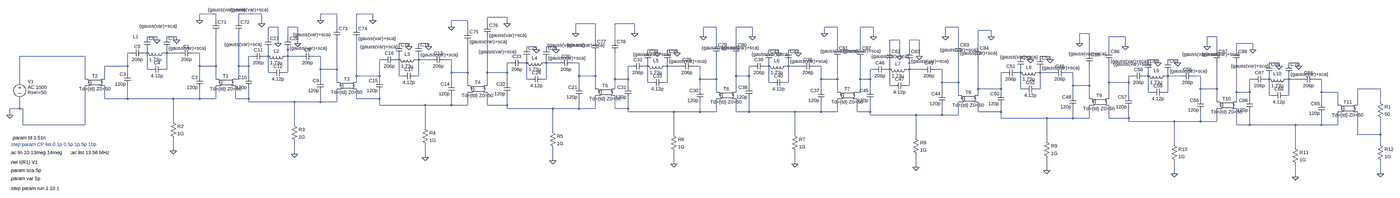
[diagram p0: schematic LTL_doubleside.asc, whole sheet]
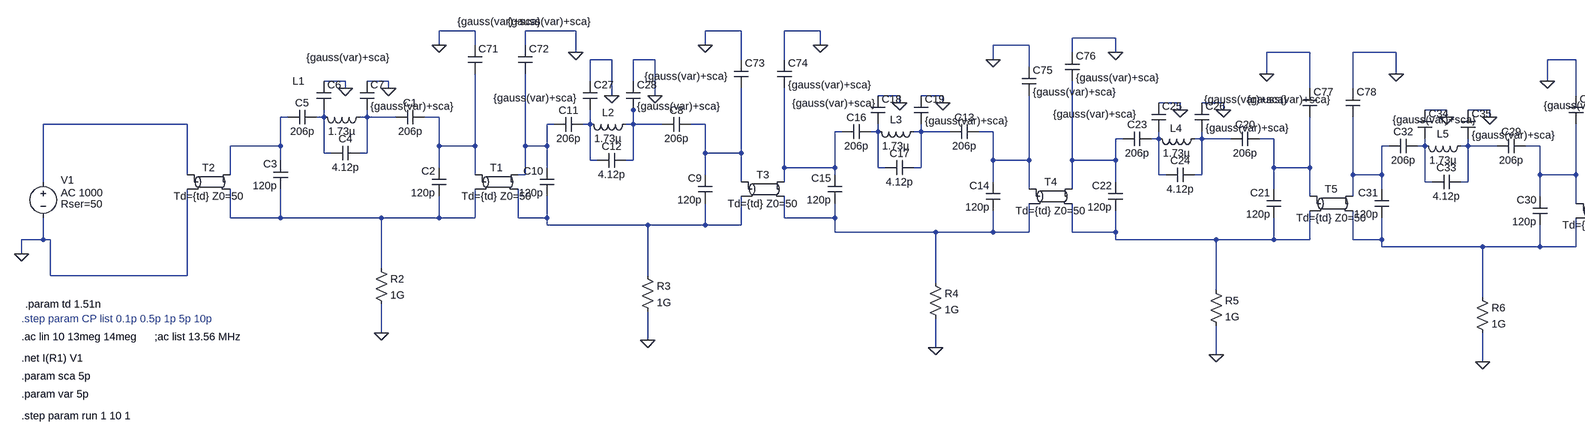
[diagram p1: schematic LTL_doubleside.asc, part, row 1 of 1, column 1 of 2]
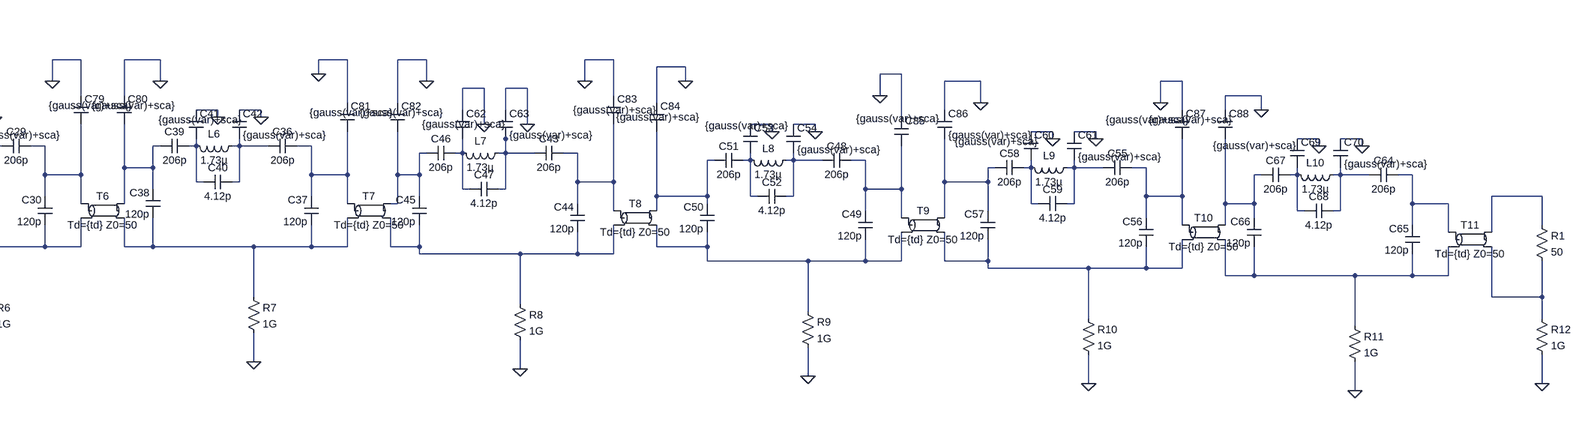
[diagram p2: schematic LTL_doubleside.asc, part, row 1 of 1, column 2 of 2]
LTL_doubleside.asc, the LTspice schematic file:
Version 4
SHEET 1 1680 680
WIRE -8800 -496 -8880 -496
WIRE -8576 -496 -8688 -496
WIRE -8208 -496 -8288 -496
WIRE -8032 -496 -8112 -496
WIRE -7376 -480 -7472 -480
WIRE -8880 -464 -8880 -496
WIRE -8800 -464 -8800 -496
WIRE -8688 -464 -8688 -496
WIRE -8288 -464 -8288 -496
WIRE -8032 -464 -8032 -496
WIRE -7568 -464 -7648 -464
WIRE -8576 -448 -8576 -496
WIRE -7472 -448 -7472 -480
WIRE -7376 -448 -7376 -480
WIRE -6944 -448 -7040 -448
WIRE -6752 -448 -6848 -448
WIRE -8496 -432 -8544 -432
WIRE -8400 -432 -8448 -432
WIRE -8208 -432 -8208 -496
WIRE -8112 -432 -8112 -496
WIRE -7648 -432 -7648 -464
WIRE -6352 -432 -6416 -432
WIRE -6176 -432 -6256 -432
WIRE -5760 -432 -5824 -432
WIRE -5584 -432 -5648 -432
WIRE -5168 -432 -5232 -432
WIRE -7568 -416 -7568 -464
WIRE -5008 -416 -5072 -416
WIRE -7040 -400 -7040 -448
WIRE -6752 -400 -6752 -448
WIRE -5824 -400 -5824 -432
WIRE -4528 -400 -4576 -400
WIRE -9088 -384 -9136 -384
WIRE -8992 -384 -9040 -384
WIRE -8544 -384 -8544 -432
WIRE -8448 -384 -8448 -432
WIRE -6416 -384 -6416 -432
WIRE -6176 -384 -6176 -432
WIRE -5584 -384 -5584 -432
WIRE -5232 -384 -5232 -432
WIRE -5008 -384 -5008 -416
WIRE -4352 -384 -4432 -384
WIRE -3904 -384 -3952 -384
WIRE -9088 -368 -9088 -384
WIRE -8992 -368 -8992 -384
WIRE -6944 -368 -6944 -448
WIRE -6848 -368 -6848 -448
WIRE -5456 -368 -5504 -368
WIRE -5360 -368 -5408 -368
WIRE -8496 -352 -8496 -432
WIRE -8400 -352 -8400 -432
WIRE -7856 -352 -7904 -352
WIRE -7760 -352 -7808 -352
WIRE -6352 -352 -6352 -432
WIRE -6256 -352 -6256 -432
WIRE -5168 -352 -5168 -432
WIRE -4576 -352 -4576 -400
WIRE -3728 -352 -3808 -352
WIRE -7856 -336 -7856 -352
WIRE -7760 -336 -7760 -352
WIRE -7232 -336 -7280 -336
WIRE -7136 -336 -7184 -336
WIRE -5760 -336 -5760 -432
WIRE -5648 -336 -5648 -432
WIRE -5072 -336 -5072 -416
WIRE -4352 -336 -4352 -384
WIRE -3952 -336 -3952 -384
WIRE -8448 -320 -8448 -336
WIRE -7232 -320 -7232 -336
WIRE -7136 -320 -7136 -336
WIRE -6640 -320 -6688 -320
WIRE -6544 -320 -6592 -320
WIRE -6048 -320 -6096 -320
WIRE -5952 -320 -6000 -320
WIRE -5504 -320 -5504 -368
WIRE -5408 -320 -5408 -368
WIRE -4432 -320 -4432 -384
WIRE -3904 -320 -3904 -384
WIRE -3808 -320 -3808 -352
WIRE -3728 -320 -3728 -352
WIRE -9216 -304 -9232 -304
WIRE -9136 -304 -9136 -320
WIRE -9136 -304 -9152 -304
WIRE -9040 -304 -9040 -320
WIRE -9040 -304 -9056 -304
WIRE -8976 -304 -9040 -304
WIRE -8880 -304 -8912 -304
WIRE -6640 -304 -6640 -320
WIRE -6544 -304 -6544 -320
WIRE -6048 -304 -6048 -320
WIRE -5952 -304 -5952 -320
WIRE -4528 -304 -4528 -400
WIRE -9440 -288 -9760 -288
WIRE -8624 -288 -8640 -288
WIRE -8544 -288 -8544 -320
WIRE -8544 -288 -8560 -288
WIRE -8448 -288 -8448 -320
WIRE -8448 -288 -8464 -288
WIRE -8384 -288 -8448 -288
WIRE -8288 -288 -8320 -288
WIRE -5456 -288 -5456 -368
WIRE -5360 -288 -5360 -368
WIRE -4816 -288 -4864 -288
WIRE -4720 -288 -4768 -288
WIRE -7984 -272 -8000 -272
WIRE -7904 -272 -7904 -288
WIRE -7904 -272 -7920 -272
WIRE -7808 -272 -7808 -288
WIRE -7808 -272 -7824 -272
WIRE -7744 -272 -7808 -272
WIRE -7648 -272 -7680 -272
WIRE -4816 -272 -4816 -288
WIRE -4720 -272 -4720 -288
WIRE -4192 -272 -4240 -272
WIRE -4096 -272 -4144 -272
WIRE -7360 -256 -7376 -256
WIRE -7280 -256 -7280 -272
WIRE -7280 -256 -7296 -256
WIRE -7184 -256 -7184 -272
WIRE -7184 -256 -7200 -256
WIRE -7120 -256 -7184 -256
WIRE -7024 -256 -7056 -256
WIRE -5408 -256 -5408 -272
WIRE -4192 -256 -4192 -272
WIRE -4096 -256 -4096 -272
WIRE -3600 -256 -3648 -256
WIRE -3504 -256 -3552 -256
WIRE -9232 -240 -9232 -304
WIRE -9232 -240 -9344 -240
WIRE -8880 -240 -8880 -304
WIRE -8800 -240 -8800 -400
WIRE -8800 -240 -8880 -240
WIRE -8688 -240 -8688 -400
WIRE -8640 -240 -8640 -288
WIRE -8640 -240 -8688 -240
WIRE -6768 -240 -6784 -240
WIRE -6688 -240 -6688 -256
WIRE -6688 -240 -6704 -240
WIRE -6592 -240 -6592 -256
WIRE -6592 -240 -6608 -240
WIRE -6528 -240 -6592 -240
WIRE -6432 -240 -6464 -240
WIRE -6176 -240 -6192 -240
WIRE -6096 -240 -6096 -256
WIRE -6096 -240 -6112 -240
WIRE -6000 -240 -6000 -256
WIRE -6000 -240 -6016 -240
WIRE -5936 -240 -6000 -240
WIRE -5840 -240 -5872 -240
WIRE -3600 -240 -3600 -256
WIRE -3504 -240 -3504 -256
WIRE -9136 -224 -9136 -304
WIRE -9120 -224 -9136 -224
WIRE -9040 -224 -9040 -304
WIRE -9040 -224 -9056 -224
WIRE -8288 -224 -8288 -288
WIRE -8208 -224 -8208 -368
WIRE -8208 -224 -8288 -224
WIRE -5584 -224 -5600 -224
WIRE -5504 -224 -5504 -256
WIRE -5504 -224 -5520 -224
WIRE -5408 -224 -5408 -256
WIRE -5408 -224 -5424 -224
WIRE -5344 -224 -5408 -224
WIRE -5248 -224 -5280 -224
WIRE -9232 -208 -9232 -240
WIRE -8544 -208 -8544 -288
WIRE -8528 -208 -8544 -208
WIRE -8448 -208 -8448 -288
WIRE -8448 -208 -8464 -208
WIRE -7648 -208 -7648 -272
WIRE -7568 -208 -7568 -352
WIRE -7568 -208 -7648 -208
WIRE -7472 -208 -7472 -384
WIRE -7376 -208 -7376 -256
WIRE -7376 -208 -7472 -208
WIRE -4944 -208 -4960 -208
WIRE -4864 -208 -4864 -224
WIRE -4864 -208 -4880 -208
WIRE -4768 -208 -4768 -224
WIRE -4768 -208 -4784 -208
WIRE -4704 -208 -4768 -208
WIRE -4608 -208 -4640 -208
WIRE -8880 -192 -8880 -240
WIRE -8640 -192 -8640 -240
WIRE -8112 -192 -8112 -368
WIRE -8000 -192 -8000 -272
WIRE -8000 -192 -8112 -192
WIRE -7904 -192 -7904 -272
WIRE -7888 -192 -7904 -192
WIRE -7808 -192 -7808 -272
WIRE -7808 -192 -7824 -192
WIRE -7024 -192 -7024 -256
WIRE -6944 -192 -6944 -304
WIRE -6944 -192 -7024 -192
WIRE -6256 -192 -6256 -288
WIRE -6192 -192 -6192 -240
WIRE -6192 -192 -6256 -192
WIRE -4320 -192 -4336 -192
WIRE -4240 -192 -4240 -208
WIRE -4240 -192 -4256 -192
WIRE -4144 -192 -4144 -208
WIRE -4144 -192 -4160 -192
WIRE -4080 -192 -4144 -192
WIRE -3984 -192 -4016 -192
WIRE -9440 -176 -9440 -288
WIRE -9344 -176 -9344 -240
WIRE -8800 -176 -8800 -240
WIRE -8688 -176 -8688 -240
WIRE -8688 -176 -8704 -176
WIRE -8288 -176 -8288 -224
WIRE -8000 -176 -8000 -192
WIRE -7280 -176 -7280 -256
WIRE -7264 -176 -7280 -176
WIRE -7184 -176 -7184 -256
WIRE -7184 -176 -7200 -176
WIRE -6848 -176 -6848 -304
WIRE -6784 -176 -6784 -240
WIRE -6784 -176 -6848 -176
WIRE -6432 -176 -6432 -240
WIRE -6352 -176 -6352 -288
WIRE -6352 -176 -6432 -176
WIRE -5840 -176 -5840 -240
WIRE -5760 -176 -5760 -272
WIRE -5760 -176 -5840 -176
WIRE -5648 -176 -5648 -272
WIRE -5600 -176 -5600 -224
WIRE -5600 -176 -5648 -176
WIRE -3728 -176 -3744 -176
WIRE -3648 -176 -3648 -192
WIRE -3648 -176 -3664 -176
WIRE -3552 -176 -3552 -192
WIRE -3552 -176 -3568 -176
WIRE -3488 -176 -3552 -176
WIRE -3392 -176 -3424 -176
WIRE -9760 -160 -9760 -288
WIRE -8208 -160 -8208 -224
WIRE -8112 -160 -8112 -192
WIRE -7648 -160 -7648 -208
WIRE -7376 -160 -7376 -208
WIRE -6688 -160 -6688 -240
WIRE -6672 -160 -6688 -160
WIRE -6592 -160 -6592 -240
WIRE -6592 -160 -6608 -160
WIRE -6096 -160 -6096 -240
WIRE -6080 -160 -6096 -160
WIRE -6000 -160 -6000 -240
WIRE -6000 -160 -6016 -160
WIRE -5248 -160 -5248 -224
WIRE -5168 -160 -5168 -288
WIRE -5168 -160 -5248 -160
WIRE -4432 -160 -4432 -256
WIRE -4336 -160 -4336 -192
WIRE -4336 -160 -4432 -160
WIRE -7568 -144 -7568 -208
WIRE -7472 -144 -7472 -208
WIRE -7024 -144 -7024 -192
WIRE -6784 -144 -6784 -176
WIRE -6192 -144 -6192 -192
WIRE -5504 -144 -5504 -224
WIRE -5488 -144 -5504 -144
WIRE -5408 -144 -5408 -224
WIRE -5408 -144 -5424 -144
WIRE -4608 -144 -4608 -208
WIRE -4528 -144 -4528 -240
WIRE -4528 -144 -4608 -144
WIRE -6944 -128 -6944 -192
WIRE -6848 -128 -6848 -176
WIRE -6432 -128 -6432 -176
WIRE -5840 -128 -5840 -176
WIRE -5600 -128 -5600 -176
WIRE -5072 -128 -5072 -272
WIRE -4960 -128 -4960 -208
WIRE -4960 -128 -5072 -128
WIRE -4864 -128 -4864 -208
WIRE -4848 -128 -4864 -128
WIRE -4768 -128 -4768 -208
WIRE -4768 -128 -4784 -128
WIRE -3984 -128 -3984 -192
WIRE -3904 -128 -3904 -256
WIRE -3904 -128 -3984 -128
WIRE -3104 -128 -3216 -128
WIRE -6352 -112 -6352 -176
WIRE -6256 -112 -6256 -192
WIRE -5760 -112 -5760 -176
WIRE -5648 -112 -5648 -176
WIRE -5648 -112 -5664 -112
WIRE -5248 -112 -5248 -160
WIRE -4960 -112 -4960 -128
WIRE -4240 -112 -4240 -192
WIRE -4224 -112 -4240 -112
WIRE -4144 -112 -4144 -192
WIRE -4144 -112 -4160 -112
WIRE -3808 -112 -3808 -256
WIRE -3744 -112 -3744 -176
WIRE -3744 -112 -3808 -112
WIRE -3392 -112 -3392 -176
WIRE -3312 -112 -3392 -112
WIRE -5168 -96 -5168 -160
WIRE -5072 -96 -5072 -128
WIRE -4608 -96 -4608 -144
WIRE -4336 -96 -4336 -160
WIRE -3648 -96 -3648 -176
WIRE -3632 -96 -3648 -96
WIRE -3552 -96 -3552 -176
WIRE -3552 -96 -3568 -96
WIRE -9344 -80 -9344 -144
WIRE -9232 -80 -9232 -144
WIRE -9232 -80 -9344 -80
WIRE -9008 -80 -9232 -80
WIRE -8880 -80 -8880 -128
WIRE -8880 -80 -9008 -80
WIRE -8800 -80 -8800 -144
WIRE -8800 -80 -8880 -80
WIRE -8704 -80 -8704 -144
WIRE -8640 -80 -8640 -128
WIRE -8640 -80 -8704 -80
WIRE -8112 -80 -8112 -128
WIRE -8000 -80 -8000 -112
WIRE -8000 -80 -8112 -80
WIRE -4528 -80 -4528 -144
WIRE -4432 -80 -4432 -160
WIRE -3984 -80 -3984 -128
WIRE -3744 -80 -3744 -112
WIRE -8640 -64 -8640 -80
WIRE -8416 -64 -8640 -64
WIRE -8288 -64 -8288 -112
WIRE -8288 -64 -8416 -64
WIRE -8208 -64 -8208 -128
WIRE -8208 -64 -8288 -64
WIRE -3904 -64 -3904 -128
WIRE -3808 -64 -3808 -112
WIRE -3392 -64 -3392 -112
WIRE -3104 -64 -3104 -128
WIRE -8000 -48 -8000 -80
WIRE -7776 -48 -8000 -48
WIRE -7648 -48 -7648 -96
WIRE -7648 -48 -7776 -48
WIRE -7568 -48 -7568 -112
WIRE -7568 -48 -7648 -48
WIRE -7472 -48 -7472 -112
WIRE -7376 -48 -7376 -96
WIRE -7376 -48 -7472 -48
WIRE -3312 -48 -3312 -112
WIRE -3216 -48 -3216 -128
WIRE -9760 -32 -9760 -80
WIRE -9760 -32 -9808 -32
WIRE -9744 -32 -9760 -32
WIRE -7376 -32 -7376 -48
WIRE -7152 -32 -7376 -32
WIRE -7024 -32 -7024 -80
WIRE -7024 -32 -7152 -32
WIRE -6944 -32 -6944 -96
WIRE -6944 -32 -7024 -32
WIRE -6848 -32 -6848 -96
WIRE -6784 -32 -6784 -80
WIRE -6784 -32 -6848 -32
WIRE -6784 -16 -6784 -32
WIRE -6560 -16 -6784 -16
WIRE -6432 -16 -6432 -64
WIRE -6432 -16 -6560 -16
WIRE -6352 -16 -6352 -80
WIRE -6352 -16 -6432 -16
WIRE -6256 -16 -6256 -80
WIRE -6192 -16 -6192 -80
WIRE -6192 -16 -6256 -16
WIRE -5968 -16 -6192 -16
WIRE -5840 -16 -5840 -64
WIRE -5840 -16 -5968 -16
WIRE -5760 -16 -5760 -80
WIRE -5760 -16 -5840 -16
WIRE -5664 -16 -5664 -80
WIRE -5600 -16 -5600 -64
WIRE -5600 -16 -5664 -16
WIRE -5072 -16 -5072 -64
WIRE -4960 -16 -4960 -48
WIRE -4960 -16 -5072 -16
WIRE -9808 0 -9808 -32
WIRE -5600 0 -5600 -16
WIRE -5376 0 -5600 0
WIRE -5248 0 -5248 -48
WIRE -5248 0 -5376 0
WIRE -5168 0 -5168 -64
WIRE -5168 0 -5248 0
WIRE -4960 16 -4960 -16
WIRE -4736 16 -4960 16
WIRE -4608 16 -4608 -32
WIRE -4608 16 -4736 16
WIRE -4528 16 -4528 -48
WIRE -4528 16 -4608 16
WIRE -4432 16 -4432 -48
WIRE -4336 16 -4336 -32
WIRE -4336 16 -4432 16
WIRE -9008 32 -9008 -80
WIRE -4336 32 -4336 16
WIRE -4112 32 -4336 32
WIRE -3984 32 -3984 -16
WIRE -3984 32 -4112 32
WIRE -3904 32 -3904 -32
WIRE -3904 32 -3984 32
WIRE -9744 48 -9744 -32
WIRE -9440 48 -9440 -144
WIRE -9440 48 -9744 48
WIRE -8416 48 -8416 -64
WIRE -3808 48 -3808 -32
WIRE -3744 48 -3744 -16
WIRE -3744 48 -3808 48
WIRE -3520 48 -3744 48
WIRE -3392 48 -3392 0
WIRE -3392 48 -3520 48
WIRE -3312 48 -3312 -16
WIRE -3312 48 -3392 48
WIRE -7776 64 -7776 -48
WIRE -7152 80 -7152 -32
WIRE -6560 96 -6560 -16
WIRE -5968 96 -5968 -16
WIRE -3216 96 -3216 -16
WIRE -3104 96 -3104 16
WIRE -3104 96 -3216 96
WIRE -5376 112 -5376 0
WIRE -4736 128 -4736 16
WIRE -4112 144 -4112 32
WIRE -3104 144 -3104 96
WIRE -3520 160 -3520 48
WIRE -9008 176 -9008 112
WIRE -8416 192 -8416 128
WIRE -7776 208 -7776 144
WIRE -7152 224 -7152 160
WIRE -6560 240 -6560 176
WIRE -5968 240 -5968 176
WIRE -5376 256 -5376 192
WIRE -4736 272 -4736 208
WIRE -4112 288 -4112 224
WIRE -3104 288 -3104 224
WIRE -3520 304 -3520 240
FLAG -9808 0 0
FLAG -9008 176 0
FLAG -9088 -368 0
FLAG -8992 -368 0
FLAG -8416 192 0
FLAG -8496 -352 0
FLAG -8400 -352 0
FLAG -7776 208 0
FLAG -7856 -336 0
FLAG -7760 -336 0
FLAG -7152 224 0
FLAG -7232 -320 0
FLAG -7136 -320 0
FLAG -6560 240 0
FLAG -6640 -304 0
FLAG -6544 -304 0
FLAG -5968 240 0
FLAG -6048 -304 0
FLAG -5952 -304 0
FLAG -5376 256 0
FLAG -5456 -288 0
FLAG -5360 -288 0
FLAG -4736 272 0
FLAG -4816 -272 0
FLAG -4720 -272 0
FLAG -4112 288 0
FLAG -4192 -256 0
FLAG -4096 -256 0
FLAG -3520 304 0
FLAG -3600 -240 0
FLAG -3504 -240 0
FLAG -3104 288 0
FLAG -3728 -320 0
FLAG -3952 -336 0
FLAG -4576 -352 0
FLAG -4352 -336 0
FLAG -5232 -384 0
FLAG -5008 -384 0
FLAG -5824 -400 0
FLAG -5584 -384 0
FLAG -6416 -384 0
FLAG -6176 -384 0
FLAG -7040 -400 0
FLAG -6752 -400 0
FLAG -7648 -432 0
FLAG -7376 -448 0
FLAG -8288 -464 0
FLAG -8032 -464 0
FLAG -8880 -464 0
FLAG -8576 -448 0
SYMBOL voltage -9760 -176 R0
WINDOW 0 39 12 Left 2
WINDOW 123 39 40 Left 2
WINDOW 39 39 65 Left 2
SYMATTR InstName V1
SYMATTR Value2 AC 1000
SYMATTR SpiceLine Rser=50
SYMATTR Value ""
SYMBOL res -3120 -80 R0
SYMATTR InstName R1
SYMATTR Value 50
SYMBOL tline -8752 -160 R0
SYMATTR InstName T1
SYMATTR Value Td={td} Z0=50
SYMBOL tline -9392 -160 R0
SYMATTR InstName T2
SYMATTR Value Td={td} Z0=50
SYMBOL cap -8912 -320 R90
WINDOW 0 0 32 VBottom 2
WINDOW 3 32 32 VTop 2
SYMATTR InstName C1
SYMATTR Value 206p
SYMBOL cap -8864 -128 R180
WINDOW 0 24 56 Left 2
WINDOW 3 24 8 Left 2
SYMATTR InstName C2
SYMATTR Value 120p
SYMBOL cap -9216 -144 R180
WINDOW 0 24 56 Left 2
WINDOW 3 24 8 Left 2
SYMATTR InstName C3
SYMATTR Value 120p
SYMBOL res -9024 16 R0
SYMATTR InstName R2
SYMATTR Value 1G
SYMBOL ind -9040 -320 R90
WINDOW 0 -49 152 VBottom 2
WINDOW 3 32 56 VTop 2
SYMATTR InstName L1
SYMATTR Value 1.73µ
SYMBOL cap -9152 -320 R90
WINDOW 0 0 32 VBottom 2
WINDOW 3 32 32 VTop 2
SYMATTR InstName C5
SYMATTR Value 206p
SYMBOL cap -9056 -240 R90
WINDOW 0 0 32 VBottom 2
WINDOW 3 32 32 VTop 2
SYMATTR InstName C4
SYMATTR Value 4.12p
SYMBOL cap -9152 -384 R0
WINDOW 3 -23 -53 Left 2
SYMATTR Value {gauss(var)+sca}
SYMATTR InstName C6
SYMBOL cap -9056 -384 R0
SYMATTR InstName C7
SYMATTR Value {gauss(var)+sca}
SYMBOL tline -8160 -144 R0
SYMATTR InstName T3
SYMATTR Value Td={td} Z0=50
SYMBOL cap -8320 -304 R90
WINDOW 0 0 32 VBottom 2
WINDOW 3 32 32 VTop 2
SYMATTR InstName C8
SYMATTR Value 206p
SYMBOL cap -8272 -112 R180
WINDOW 0 24 56 Left 2
WINDOW 3 24 8 Left 2
SYMATTR InstName C9
SYMATTR Value 120p
SYMBOL cap -8624 -128 R180
WINDOW 0 24 56 Left 2
WINDOW 3 24 8 Left 2
SYMATTR InstName C10
SYMATTR Value 120p
SYMBOL res -8432 32 R0
SYMATTR InstName R3
SYMATTR Value 1G
SYMBOL ind -8448 -304 R90
WINDOW 0 5 56 VBottom 2
WINDOW 3 32 56 VTop 2
SYMATTR InstName L2
SYMATTR Value 1.73µ
SYMBOL cap -8560 -304 R90
WINDOW 0 0 32 VBottom 2
WINDOW 3 32 32 VTop 2
SYMATTR InstName C11
SYMATTR Value 206p
SYMBOL cap -8464 -224 R90
WINDOW 0 0 32 VBottom 2
WINDOW 3 32 32 VTop 2
SYMATTR InstName C12
SYMATTR Value 4.12p
SYMBOL tline -7520 -128 R0
SYMATTR InstName T4
SYMATTR Value Td={td} Z0=50
SYMBOL cap -7680 -288 R90
WINDOW 0 0 32 VBottom 2
WINDOW 3 32 32 VTop 2
SYMATTR InstName C13
SYMATTR Value 206p
SYMBOL cap -7632 -96 R180
WINDOW 0 24 56 Left 2
WINDOW 3 24 8 Left 2
SYMATTR InstName C14
SYMATTR Value 120p
SYMBOL cap -7984 -112 R180
WINDOW 0 24 56 Left 2
WINDOW 3 24 8 Left 2
SYMATTR InstName C15
SYMATTR Value 120p
SYMBOL res -7792 48 R0
SYMATTR InstName R4
SYMATTR Value 1G
SYMBOL ind -7808 -288 R90
WINDOW 0 5 56 VBottom 2
WINDOW 3 32 56 VTop 2
SYMATTR InstName L3
SYMATTR Value 1.73µ
SYMBOL cap -7920 -288 R90
WINDOW 0 0 32 VBottom 2
WINDOW 3 32 32 VTop 2
SYMATTR InstName C16
SYMATTR Value 206p
SYMBOL cap -7824 -208 R90
WINDOW 0 0 32 VBottom 2
WINDOW 3 32 32 VTop 2
SYMATTR InstName C17
SYMATTR Value 4.12p
SYMBOL cap -7920 -352 R0
WINDOW 3 -175 17 Left 2
SYMATTR Value {gauss(var)+sca}
SYMATTR InstName C18
SYMBOL cap -7824 -352 R0
SYMATTR InstName C19
SYMATTR Value {gauss(var)+sca}
SYMBOL tline -6896 -112 R0
SYMATTR InstName T5
SYMATTR Value Td={td} Z0=50
SYMBOL cap -7056 -272 R90
WINDOW 0 0 32 VBottom 2
WINDOW 3 32 32 VTop 2
SYMATTR InstName C20
SYMATTR Value 206p
SYMBOL cap -7008 -80 R180
WINDOW 0 24 56 Left 2
WINDOW 3 24 8 Left 2
SYMATTR InstName C21
SYMATTR Value 120p
SYMBOL cap -7360 -96 R180
WINDOW 0 24 56 Left 2
WINDOW 3 24 8 Left 2
SYMATTR InstName C22
SYMATTR Value 120p
SYMBOL res -7168 64 R0
SYMATTR InstName R5
SYMATTR Value 1G
SYMBOL ind -7184 -272 R90
WINDOW 0 8 57 VBottom 2
WINDOW 3 32 56 VTop 2
SYMATTR InstName L4
SYMATTR Value 1.73µ
SYMBOL cap -7296 -272 R90
WINDOW 0 0 32 VBottom 2
WINDOW 3 32 32 VTop 2
SYMATTR InstName C23
SYMATTR Value 206p
SYMBOL cap -7200 -192 R90
WINDOW 0 0 32 VBottom 2
WINDOW 3 32 32 VTop 2
SYMATTR InstName C24
SYMATTR Value 4.12p
SYMBOL cap -7296 -336 R0
WINDOW 3 -219 25 Left 2
SYMATTR Value {gauss(var)+sca}
SYMATTR InstName C25
SYMBOL cap -7200 -336 R0
SYMATTR InstName C26
SYMATTR Value {gauss(var)+sca}
SYMBOL cap -8560 -384 R0
WINDOW 3 -199 37 Left 2
SYMATTR Value {gauss(var)+sca}
SYMATTR InstName C27
SYMBOL cap -8464 -384 R0
SYMATTR InstName C28
SYMATTR Value {gauss(var)+sca}
SYMBOL tline -6304 -96 R0
SYMATTR InstName T6
SYMATTR Value Td={td} Z0=50
SYMBOL cap -6464 -256 R90
WINDOW 0 0 32 VBottom 2
WINDOW 3 32 32 VTop 2
SYMATTR InstName C29
SYMATTR Value 206p
SYMBOL cap -6416 -64 R180
WINDOW 0 24 56 Left 2
WINDOW 3 24 8 Left 2
SYMATTR InstName C30
SYMATTR Value 120p
SYMBOL cap -6768 -80 R180
WINDOW 0 24 56 Left 2
WINDOW 3 24 8 Left 2
SYMATTR InstName C31
SYMATTR Value 120p
SYMBOL res -6576 80 R0
SYMATTR InstName R6
SYMATTR Value 1G
SYMBOL ind -6592 -256 R90
WINDOW 0 5 56 VBottom 2
WINDOW 3 32 56 VTop 2
SYMATTR InstName L5
SYMATTR Value 1.73µ
SYMBOL cap -6704 -256 R90
WINDOW 0 0 32 VBottom 2
WINDOW 3 32 32 VTop 2
SYMATTR InstName C32
SYMATTR Value 206p
SYMBOL cap -6608 -176 R90
WINDOW 0 0 32 VBottom 2
WINDOW 3 32 32 VTop 2
SYMATTR InstName C33
SYMATTR Value 4.12p
SYMBOL cap -6704 -320 R0
WINDOW 3 -56 22 Left 2
SYMATTR Value {gauss(var)+sca}
SYMATTR InstName C34
SYMBOL cap -6608 -320 R0
SYMATTR InstName C35
SYMATTR Value {gauss(var)+sca}
SYMBOL tline -5712 -96 R0
SYMATTR InstName T7
SYMATTR Value Td={td} Z0=50
SYMBOL cap -5872 -256 R90
WINDOW 0 0 32 VBottom 2
WINDOW 3 32 32 VTop 2
SYMATTR InstName C36
SYMATTR Value 206p
SYMBOL cap -5824 -64 R180
WINDOW 0 24 56 Left 2
WINDOW 3 24 8 Left 2
SYMATTR InstName C37
SYMATTR Value 120p
SYMBOL cap -6176 -80 R180
WINDOW 0 24 56 Left 2
WINDOW 3 24 8 Left 2
SYMATTR InstName C38
SYMATTR Value 120p
SYMBOL res -5984 80 R0
SYMATTR InstName R7
SYMATTR Value 1G
SYMBOL ind -6000 -256 R90
WINDOW 0 5 56 VBottom 2
WINDOW 3 32 56 VTop 2
SYMATTR InstName L6
SYMATTR Value 1.73µ
SYMBOL cap -6112 -256 R90
WINDOW 0 0 32 VBottom 2
WINDOW 3 32 32 VTop 2
SYMATTR InstName C39
SYMATTR Value 206p
SYMBOL cap -6016 -176 R90
WINDOW 0 0 32 VBottom 2
WINDOW 3 32 32 VTop 2
SYMATTR InstName C40
SYMATTR Value 4.12p
SYMBOL cap -6112 -320 R0
WINDOW 3 -68 22 Left 2
SYMATTR Value {gauss(var)+sca}
SYMATTR InstName C41
SYMBOL cap -6016 -320 R0
SYMATTR InstName C42
SYMATTR Value {gauss(var)+sca}
SYMBOL tline -5120 -80 R0
SYMATTR InstName T8
SYMATTR Value Td={td} Z0=50
SYMBOL cap -5280 -240 R90
WINDOW 0 0 32 VBottom 2
WINDOW 3 32 32 VTop 2
SYMATTR InstName C43
SYMATTR Value 206p
SYMBOL cap -5232 -48 R180
WINDOW 0 24 56 Left 2
WINDOW 3 24 8 Left 2
SYMATTR InstName C44
SYMATTR Value 120p
SYMBOL cap -5584 -64 R180
WINDOW 0 24 56 Left 2
WINDOW 3 24 8 Left 2
SYMATTR InstName C45
SYMATTR Value 120p
SYMBOL res -5392 96 R0
SYMATTR InstName R8
SYMATTR Value 1G
SYMBOL ind -5408 -240 R90
WINDOW 0 5 56 VBottom 2
WINDOW 3 32 56 VTop 2
SYMATTR InstName L7
SYMATTR Value 1.73µ
SYMBOL cap -5520 -240 R90
WINDOW 0 0 32 VBottom 2
WINDOW 3 32 32 VTop 2
SYMATTR InstName C46
SYMATTR Value 206p
SYMBOL cap -5424 -160 R90
WINDOW 0 0 32 VBottom 2
WINDOW 3 32 32 VTop 2
SYMATTR InstName C47
SYMATTR Value 4.12p
SYMBOL tline -4480 -64 R0
SYMATTR InstName T9
SYMATTR Value Td={td} Z0=50
SYMBOL cap -4640 -224 R90
WINDOW 0 0 32 VBottom 2
WINDOW 3 32 32 VTop 2
SYMATTR InstName C48
SYMATTR Value 206p
SYMBOL cap -4592 -32 R180
WINDOW 0 24 56 Left 2
WINDOW 3 24 8 Left 2
SYMATTR InstName C49
SYMATTR Value 120p
SYMBOL cap -4944 -48 R180
WINDOW 0 24 56 Left 2
WINDOW 3 24 8 Left 2
SYMATTR InstName C50
SYMATTR Value 120p
SYMBOL res -4752 112 R0
SYMATTR InstName R9
SYMATTR Value 1G
SYMBOL ind -4768 -224 R90
WINDOW 0 5 56 VBottom 2
WINDOW 3 32 56 VTop 2
SYMATTR InstName L8
SYMATTR Value 1.73µ
SYMBOL cap -4880 -224 R90
WINDOW 0 0 32 VBottom 2
WINDOW 3 32 32 VTop 2
SYMATTR InstName C51
SYMATTR Value 206p
SYMBOL cap -4784 -144 R90
WINDOW 0 0 32 VBottom 2
WINDOW 3 32 32 VTop 2
SYMATTR InstName C52
SYMATTR Value 4.12p
SYMBOL cap -4880 -288 R0
WINDOW 3 -85 3 Left 2
SYMATTR Value {gauss(var)+sca}
SYMATTR InstName C53
SYMBOL cap -4784 -288 R0
SYMATTR InstName C54
SYMATTR Value {gauss(var)+sca}
SYMBOL tline -3856 -48 R0
SYMATTR InstName T10
SYMATTR Value Td={td} Z0=50
SYMBOL cap -4016 -208 R90
WINDOW 0 0 32 VBottom 2
WINDOW 3 32 32 VTop 2
SYMATTR InstName C55
SYMATTR Value 206p
SYMBOL cap -3968 -16 R180
WINDOW 0 24 56 Left 2
WINDOW 3 24 8 Left 2
SYMATTR InstName C56
SYMATTR Value 120p
SYMBOL cap -4320 -32 R180
WINDOW 0 24 56 Left 2
WINDOW 3 24 8 Left 2
SYMATTR InstName C57
SYMATTR Value 120p
SYMBOL res -4128 128 R0
SYMATTR InstName R10
SYMATTR Value 1G
SYMBOL ind -4144 -208 R90
WINDOW 0 5 56 VBottom 2
WINDOW 3 32 56 VTop 2
SYMATTR InstName L9
SYMATTR Value 1.73µ
SYMBOL cap -4256 -208 R90
WINDOW 0 0 32 VBottom 2
WINDOW 3 32 32 VTop 2
SYMATTR InstName C58
SYMATTR Value 206p
SYMBOL cap -4160 -128 R90
WINDOW 0 0 32 VBottom 2
WINDOW 3 32 32 VTop 2
SYMATTR InstName C59
SYMATTR Value 4.12p
SYMBOL cap -4256 -272 R0
WINDOW 3 -154 22 Left 2
SYMATTR Value {gauss(var)+sca}
SYMATTR InstName C60
SYMBOL cap -4160 -272 R0
SYMATTR InstName C61
SYMATTR Value {gauss(var)+sca}
SYMBOL cap -5520 -320 R0
WINDOW 3 -74 32 Left 2
SYMATTR Value {gauss(var)+sca}
SYMATTR InstName C62
SYMBOL cap -5424 -320 R0
SYMATTR InstName C63
SYMATTR Value {gauss(var)+sca}
SYMBOL tline -3264 -32 R0
SYMATTR InstName T11
SYMATTR Value Td={td} Z0=50
SYMBOL cap -3424 -192 R90
WINDOW 0 0 32 VBottom 2
WINDOW 3 32 32 VTop 2
SYMATTR InstName C64
SYMATTR Value 206p
SYMBOL cap -3376 0 R180
WINDOW 0 24 56 Left 2
WINDOW 3 24 8 Left 2
SYMATTR InstName C65
SYMATTR Value 120p
SYMBOL cap -3728 -16 R180
WINDOW 0 24 56 Left 2
WINDOW 3 24 8 Left 2
SYMATTR InstName C66
SYMATTR Value 120p
SYMBOL res -3536 144 R0
SYMATTR InstName R11
SYMATTR Value 1G
SYMBOL ind -3552 -192 R90
WINDOW 0 5 56 VBottom 2
WINDOW 3 32 56 VTop 2
SYMATTR InstName L10
SYMATTR Value 1.73µ
SYMBOL cap -3664 -192 R90
WINDOW 0 0 32 VBottom 2
WINDOW 3 32 32 VTop 2
SYMATTR InstName C67
SYMATTR Value 206p
SYMBOL cap -3568 -112 R90
WINDOW 0 0 32 VBottom 2
WINDOW 3 32 32 VTop 2
SYMATTR InstName C68
SYMATTR Value 4.12p
SYMBOL cap -3664 -256 R0
WINDOW 3 -172 15 Left 2
SYMATTR Value {gauss(var)+sca}
SYMATTR InstName C69
SYMBOL cap -3568 -256 R0
SYMATTR InstName C70
SYMATTR Value {gauss(var)+sca}
SYMBOL res -3120 128 R0
SYMATTR InstName R12
SYMATTR Value 1G
SYMBOL cap -8816 -464 R0
WINDOW 3 -23 -53 Left 2
SYMATTR Value {gauss(var)+sca}
SYMATTR InstName C71
SYMBOL cap -8704 -464 R0
WINDOW 3 -23 -53 Left 2
SYMATTR Value {gauss(var)+sca}
SYMATTR InstName C72
SYMBOL cap -8224 -432 R0
WINDOW 3 -199 37 Left 2
SYMATTR Value {gauss(var)+sca}
SYMATTR InstName C73
SYMBOL cap -8128 -432 R0
SYMATTR InstName C74
SYMATTR Value {gauss(var)+sca}
SYMBOL cap -7584 -416 R0
SYMATTR InstName C75
SYMATTR Value {gauss(var)+sca}
SYMBOL cap -7488 -448 R0
SYMATTR InstName C76
SYMATTR Value {gauss(var)+sca}
SYMBOL cap -6960 -368 R0
WINDOW 3 -219 25 Left 2
SYMATTR Value {gauss(var)+sca}
SYMATTR InstName C77
SYMBOL cap -6864 -368 R0
WINDOW 3 -219 25 Left 2
SYMATTR Value {gauss(var)+sca}
SYMATTR InstName C78
SYMBOL cap -6368 -352 R0
WINDOW 3 -56 22 Left 2
SYMATTR Value {gauss(var)+sca}
SYMATTR InstName C79
SYMBOL cap -6272 -352 R0
WINDOW 3 -56 22 Left 2
SYMATTR Value {gauss(var)+sca}
SYMATTR InstName C80
SYMBOL cap -5776 -336 R0
WINDOW 3 -68 22 Left 2
SYMATTR Value {gauss(var)+sca}
SYMATTR InstName C81
SYMBOL cap -5664 -336 R0
WINDOW 3 -68 22 Left 2
SYMATTR Value {gauss(var)+sca}
SYMATTR InstName C82
SYMBOL cap -5184 -352 R0
WINDOW 3 -74 32 Left 2
SYMATTR Value {gauss(var)+sca}
SYMATTR InstName C83
SYMBOL cap -5088 -336 R0
WINDOW 3 -74 32 Left 2
SYMATTR Value {gauss(var)+sca}
SYMATTR InstName C84
SYMBOL cap -4544 -304 R0
WINDOW 3 -85 3 Left 2
SYMATTR Value {gauss(var)+sca}
SYMATTR InstName C85
SYMBOL cap -4448 -320 R0
SYMATTR InstName C86
SYMATTR Value {gauss(var)+sca}
SYMBOL cap -3920 -320 R0
WINDOW 3 -154 22 Left 2
SYMATTR Value {gauss(var)+sca}
SYMATTR InstName C87
SYMBOL cap -3824 -320 R0
WINDOW 3 -154 22 Left 2
SYMATTR Value {gauss(var)+sca}
SYMATTR InstName C88
TEXT -9808 184 Left 2 !.ac lin 10 13meg 14meg
TEXT -9808 232 Left 2 !.net I(R1) V1
TEXT -9808 144 Left 2 ;.step param CP list 0.1p 0.5p 1p 5p 10p
TEXT -9800 112 Left 2 !.param td 1.51n
TEXT -9808 272 Left 2 !.param sca 5p
TEXT -9808 312 Left 2 !.param var 5p
TEXT -9808 360 Left 2 !.step param run 1 10 1
TEXT -9512 184 Left 2 !;ac list 13.56 MHz

The netlist it stands for:
* LTL_doubleside.asc
V1 N006 0 AC 1000 Rser=50
R1 N042 N053 50
T1 N005 N043 N007 N044 Td={td} Z0=50
T2 N006 0 N002 N043 Td={td} Z0=50
C1 N005 N004 206p
C2 N043 N005 120p
C3 N043 N002 120p
R2 N043 0 1G
L1 N004 N003 1.73µ
C5 N003 N002 206p
C4 N004 N003 4.12p
C6 0 N003 {gauss(var)+sca}
C7 0 N004 {gauss(var)+sca}
T3 N009 N044 N010 N045 Td={td} Z0=50
C8 N009 N001 206p
C9 N044 N009 120p
C10 N044 N007 120p
R3 N044 0 1G
L2 N001 N008 1.73µ
C11 N008 N007 206p
C12 N001 N008 4.12p
T4 N013 N045 N014 N046 Td={td} Z0=50
C13 N013 N012 206p
C14 N045 N013 120p
C15 N045 N010 120p
R4 N045 0 1G
L3 N012 N011 1.73µ
C16 N011 N010 206p
C17 N012 N011 4.12p
C18 0 N011 {gauss(var)+sca}
C19 0 N012 {gauss(var)+sca}
T5 N017 N046 N019 N047 Td={td} Z0=50
C20 N017 N016 206p
C21 N046 N017 120p
C22 N046 N014 120p
R5 N046 0 1G
L4 N016 N015 1.73µ
C23 N015 N014 206p
C24 N016 N015 4.12p
C25 0 N015 {gauss(var)+sca}
C26 0 N016 {gauss(var)+sca}
C27 0 N008 {gauss(var)+sca}
C28 0 N001 {gauss(var)+sca}
T6 N022 N047 N023 N048 Td={td} Z0=50
C29 N022 N021 206p
C30 N047 N022 120p
C31 N047 N019 120p
R6 N047 0 1G
L5 N021 N020 1.73µ
C32 N020 N019 206p
C33 N021 N020 4.12p
C34 0 N020 {gauss(var)+sca}
C35 0 N021 {gauss(var)+sca}
T7 N026 N048 N027 N049 Td={td} Z0=50
C36 N026 N025 206p
C37 N048 N026 120p
C38 N048 N023 120p
R7 N048 0 1G
L6 N025 N024 1.73µ
C39 N024 N023 206p
C40 N025 N024 4.12p
C41 0 N024 {gauss(var)+sca}
C42 0 N025 {gauss(var)+sca}
T8 N029 N049 N030 N050 Td={td} Z0=50
C43 N029 N018 206p
C44 N049 N029 120p
C45 N049 N027 120p
R8 N049 0 1G
L7 N018 N028 1.73µ
C46 N028 N027 206p
C47 N018 N028 4.12p
T9 N033 N050 N034 N051 Td={td} Z0=50
C48 N033 N032 206p
C49 N050 N033 120p
C50 N050 N030 120p
R9 N050 0 1G
L8 N032 N031 1.73µ
C51 N031 N030 206p
C52 N032 N031 4.12p
C53 0 N031 {gauss(var)+sca}
C54 0 N032 {gauss(var)+sca}
T10 N037 N051 N038 N052 Td={td} Z0=50
C55 N037 N036 206p
C56 N051 N037 120p
C57 N051 N034 120p
R10 N051 0 1G
L9 N036 N035 1.73µ
C58 N035 N034 206p
C59 N036 N035 4.12p
C60 0 N035 {gauss(var)+sca}
C61 0 N036 {gauss(var)+sca}
C62 0 N028 {gauss(var)+sca}
C63 0 N018 {gauss(var)+sca}
T11 N041 N052 N042 N053 Td={td} Z0=50
C64 N041 N040 206p
C65 N052 N041 120p
C66 N052 N038 120p
R11 N052 0 1G
L10 N040 N039 1.73µ
C67 N039 N038 206p
C68 N040 N039 4.12p
C69 0 N039 {gauss(var)+sca}
C70 0 N040 {gauss(var)+sca}
R12 N053 0 1G
C71 0 N005 {gauss(var)+sca}
C72 0 N007 {gauss(var)+sca}
C73 0 N009 {gauss(var)+sca}
C74 0 N010 {gauss(var)+sca}
C75 0 N013 {gauss(var)+sca}
C76 0 N014 {gauss(var)+sca}
C77 0 N017 {gauss(var)+sca}
C78 0 N019 {gauss(var)+sca}
C79 0 N022 {gauss(var)+sca}
C80 0 N023 {gauss(var)+sca}
C81 0 N026 {gauss(var)+sca}
C82 0 N027 {gauss(var)+sca}
C83 0 N029 {gauss(var)+sca}
C84 0 N030 {gauss(var)+sca}
C85 0 N033 {gauss(var)+sca}
C86 0 N034 {gauss(var)+sca}
C87 0 N037 {gauss(var)+sca}
C88 0 N038 {gauss(var)+sca}
.ac lin 10 13meg 14meg
.net I(R1) V1
* .step param CP list 0.1p 0.5p 1p 5p 10p
.param td 1.51n
.param sca 5p
.param var 5p
.step param run 1 10 1
;ac list 13.56 MHz
.backanno
.end